# EAGLE board BeagleBeer (EAGLE 6.4)
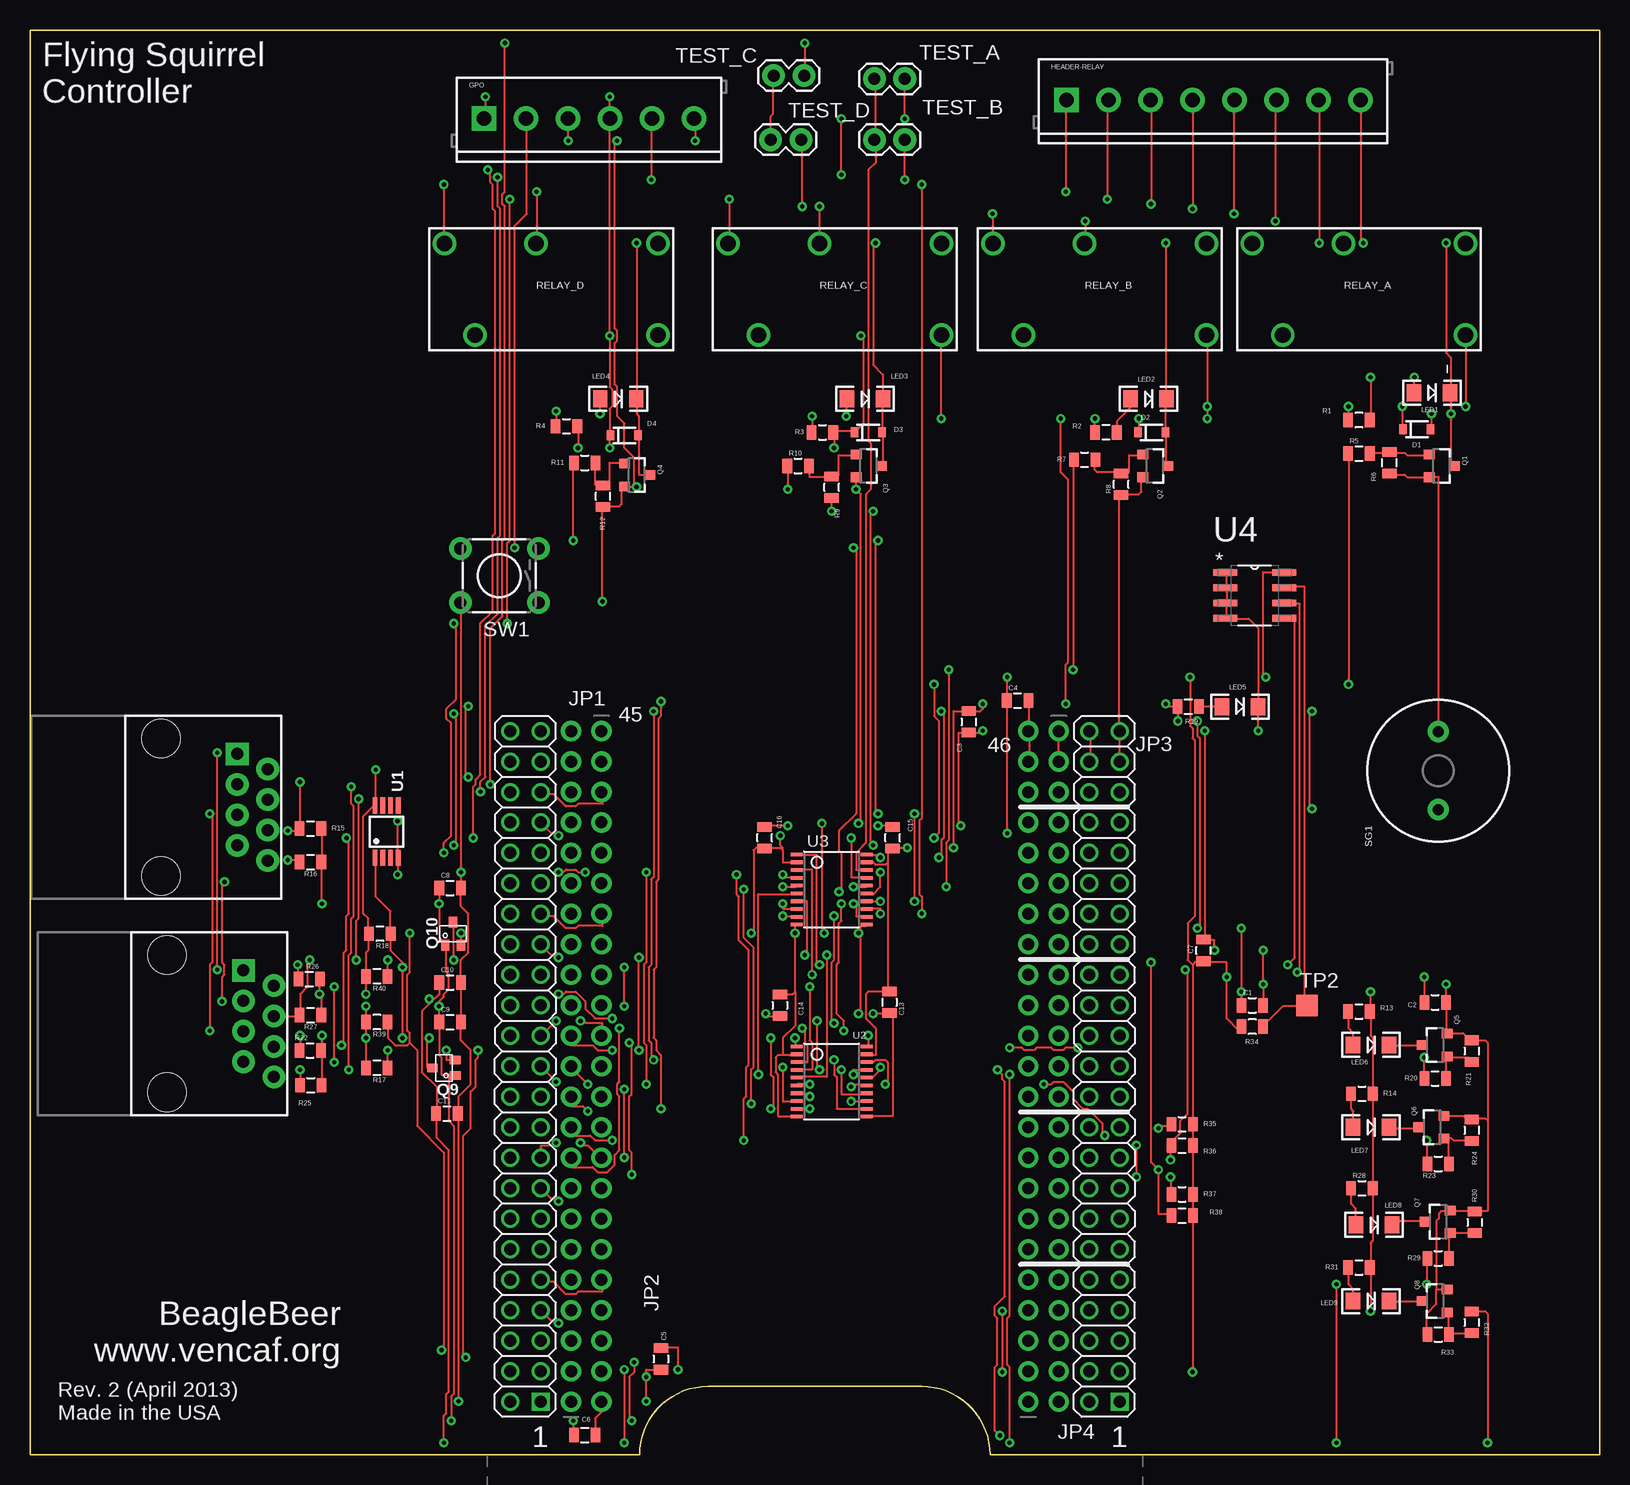
[diagram p2: board, top side]
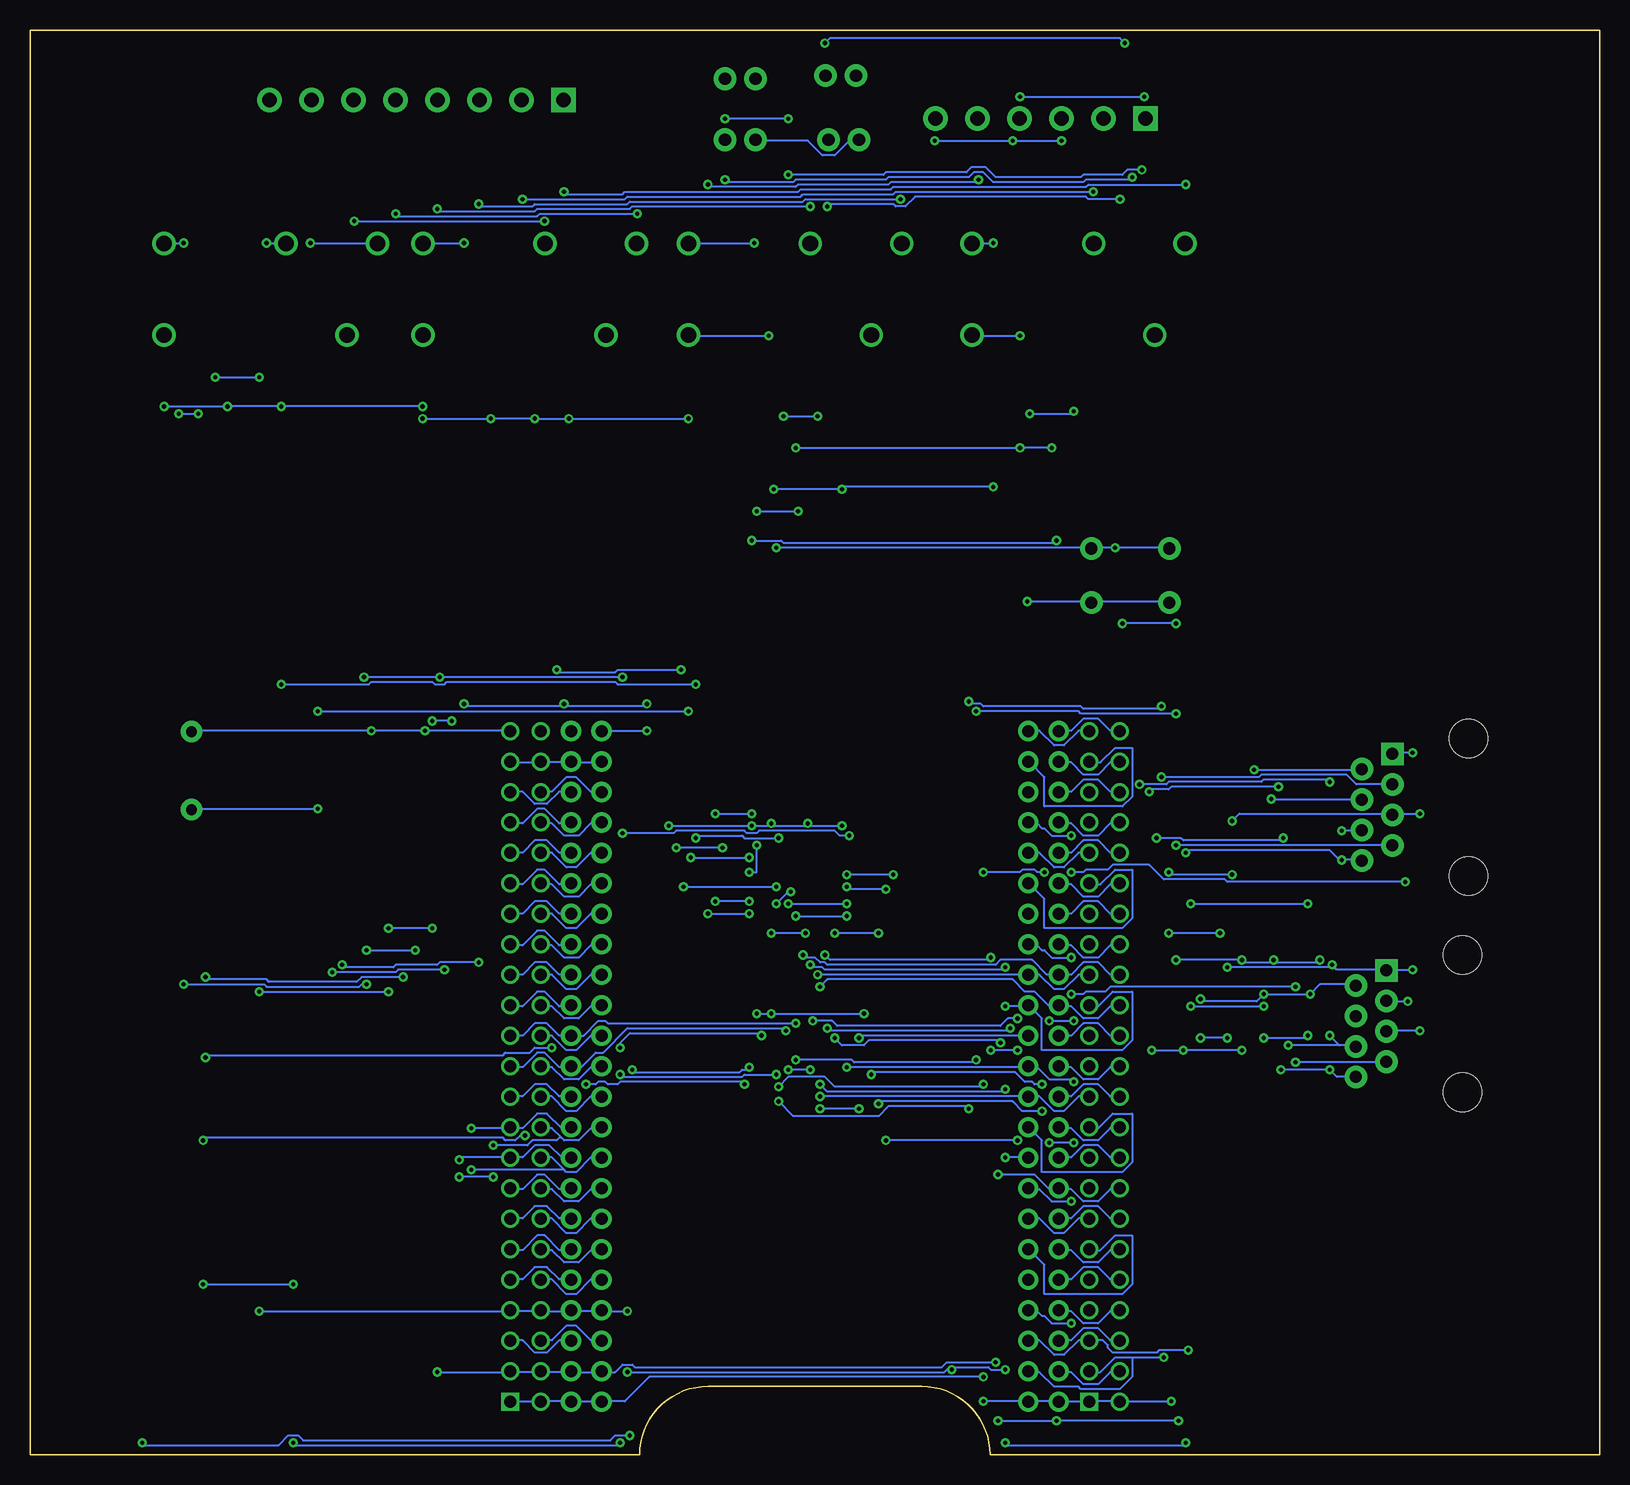
[diagram p3: board, bottom side, seen from below]

Size 130.81 x 118.75 mm. Coordinates in mm from the lower left corner, seen from the top.
Copper layers (1*16): Top 0.0178mm / dielectric 59mil / Bottom 0.0178mm
Design rules "SSC-EAGLE-2Lyr_v1.0.0.3": minimum track width 6mil, minimum drill 14mil, track to track 6mil, track to pad 6mil, pad to pad 6mil, via to via 6mil, smd to smd 6mil, copper to edge 20mil, drill to drill 16mil, minimum pad ring 8mil, minimum via ring 8mil, stop-mask expansion 3mil, vias tented up to drill 0mil, thermal gap 10mil

## Footprints (pad centres in the part's own frame; a part is rotated, then mirrored left to right if it is on the bottom)
0805 = smd 0.8 x 1.2: 1 -0.9,0; 2 0.9,0
SOD-323 = smd 0.63 x 0.83: 1 -1.15,0; 2 1.15,0
SCREWTERMINAL-3.5MM-6 = drill 1.2 pad 2.032 square: 1 0,0 | drill 1.2 pad 2.032: 2 3.5,0; 3 7,0; 4 10.5,0; 5 14,0; 6 17.5,0
SCREWTERMINAL-3.5MM-8 = drill 1.2 pad 2.032 square: 1 0,0 | drill 1.2 pad 2.032: 2 3.5,0; 3 7,0; 4 10.5,0; 5 14,0; 6 17.5,0; 7 21,0; 8 24.5,0
1X23_ROUND_70MIL = drill 1 pad 1.676: 1 -27.94,0; 2 -25.4,0; 3 -22.86,0; 4 -20.32,0; 5 -17.78,0; 6 -15.24,0; 7 -12.7,0; 8 -10.16,0; 9 -7.62,0; 10 -5.08,0; 11 -2.54,0; 12 0,0; 13 2.54,0; 14 5.08,0; 15 7.62,0; 16 10.16,0; 17 12.7,0; 18 15.24,0; 19 17.78,0; 20 20.32,0; 21 22.86,0; 22 25.4,0; 23 27.94,0
LED-1206 = smd 1.2 x 1.4: A -1.5,0; C 1.5,0
SOT23-3 = smd 0.8 x 0.9: 1 -0.95,-1; 2 0.95,-1; 3 0,1.1
SOT323 = smd 0.7 x 0.9: 1 -0.65,-0.95; 2 0.65,-0.95; 3 0,0.95
RELAY-G5Q = drill 1.3: 1 8.89,3.81; 2 -1.27,3.81; 3 -8.89,3.81; 4 -6.35,-3.81; 5 8.89,-3.81
RJ45-8 = drill 1 pad 1.88 square: 1 -4.445,6.35 | drill 1 pad 1.88: 2 -3.175,8.89; 3 -1.905,6.35; 4 -0.635,8.89; 5 0.635,6.35; 6 1.905,8.89; 7 3.175,6.35; 8 4.445,8.89 | hole 3.2: -5.715,0; 5.715,0
BUZZER-12MM = drill 0.9 pad 1.778: + 3.25,0; - -3.25,0
TACTILE-PTH = drill 1.016 pad 1.88: 1 -3.251,2.261; 2 3.251,2.261; 3 -3.251,-2.261; 4 3.251,-2.261
1X02 = drill 1.016 pad 1.88: 1 0,0; 2 2.54,0
TP18SQ = smd 1.8 x 1.8: TP 0,0
UMAX8 = smd 0.4 x 1.35: 1 -0.975,-2.175; 2 -0.325,-2.175; 3 0.325,-2.175; 4 0.975,-2.175; 5 0.975,2.175; 6 0.325,2.175; 7 -0.325,2.175; 8 -0.975,2.175
TSSOP20 = smd 0.305 x 0.991: 1 -2.925,-2.918; 2 -2.275,-2.918; 3 -1.625,-2.918; 4 -0.975,-2.918; 5 -0.325,-2.918; 6 0.325,-2.918; 7 0.975,-2.918; 8 1.625,-2.918; 9 2.275,-2.918; 10 2.925,-2.918; 11 2.925,2.918; 12 2.275,2.918; 13 1.625,2.918; 14 0.975,2.918; 15 0.325,2.918; 16 -0.325,2.918; 17 -0.975,2.918; 18 -1.625,2.918; 19 -2.275,2.918; 20 -2.925,2.918
SOIC127P600X175-8N = smd 1.981 x 0.559: 1 -2.464,1.905; 2 -2.464,0.635; 3 -2.464,-0.635; 4 -2.464,-1.905; 5 2.464,-1.905; 6 2.464,-0.635; 7 2.464,0.635; 8 2.464,1.905
BEAGLEBEER_SHIELD = drill 1 square: 1 -22.225,-1.27; 47 26.035,-1.27 | drill 1: 2 -24.765,-1.27; 3 -22.225,1.27; 4 -24.765,1.27; 5 -22.225,3.81; 6 -24.765,3.81; 7 -22.225,6.35; 8 -24.765,6.35; 9 -22.225,8.89; 10 -24.765,8.89; 11 -22.225,11.43; 12 -24.765,11.43; 13 -22.225,13.97; 14 -24.765,13.97; 15 -22.225,16.51; 16 -24.765,16.51; 17 -22.225,19.05; 18 -24.765,19.05; 19 -22.225,21.59; 20 -24.765,21.59; 21 -22.225,24.13; 22 -24.765,24.13; 23 -22.225,26.67; 24 -24.765,26.67; 25 -22.225,29.21; 26 -24.765,29.21; 27 -22.225,31.75; 28 -24.765,31.75; 29 -22.225,34.29; 30 -24.765,34.29; 31 -22.225,36.83; 32 -24.765,36.83; 33 -22.225,39.37; 34 -24.765,39.37; 35 -22.225,41.91; 36 -24.765,41.91; 37 -22.225,44.45; 38 -24.765,44.45; 39 -22.225,46.99; 40 -24.765,46.99; 41 -22.225,49.53; 42 -24.765,49.53; 43 -22.225,52.07; 44 -24.765,52.07; 45 -22.225,54.61; 46 -24.765,54.61; 48 23.495,-1.27; 49 26.035,1.27; 50 23.495,1.27; 51 26.035,3.81; 52 23.495,3.81; 53 26.035,6.35; 54 23.495,6.35; 55 26.035,8.89; 56 23.495,8.89; 57 26.035,11.43; 58 23.495,11.43; 59 26.035,13.97; 60 23.495,13.97; 61 26.035,16.51; 62 23.495,16.51; 63 26.035,19.05; 64 23.495,19.05; 65 26.035,21.59; 66 23.495,21.59; 67 26.035,24.13; 68 23.495,24.13; 69 26.035,26.67; 70 23.495,26.67; 71 26.035,29.21; 72 23.495,29.21; 73 26.035,31.75; 74 23.495,31.75; 75 26.035,34.29; 76 23.495,34.29; 77 26.035,36.83; 78 23.495,36.83; 79 26.035,39.37; 80 23.495,39.37; 81 26.035,41.91; 82 23.495,41.91; 83 26.035,44.45; 84 23.495,44.45; 85 26.035,46.99; 86 23.495,46.99; 87 26.035,49.53; 88 23.495,49.53; 89 26.035,52.07; 90 23.495,52.07; 91 26.035,54.61; 92 23.495,54.61

## Placement (x,y rotation side)
C1  0.1 uF  [0805]  101.85,37.47 0 top
C2  0.1 uF  [0805]  117.09,37.72 0 top
C3  0.1 uF  [0805]  78.23,61.09 270 top
C4  0.1 uF  [0805]  82.3,62.87 0 top
C5  0.1 uF  [0805]  52.58,8 270 top
C6  0.1 uF  [0805]  46.23,1.65 0 top
C7  0.1 uF  [0805]  97.79,42.04 90 top
C8  0.1 uF  [0805]  35,47.24 0 top
C9  0.1 uF  [0805]  35,36.07 0 top
C10  0.1 uF  [0805]  35,39.37 0 top
C11  0.1 uF  [0805]  34.75,28.45 0 top
C13  0.1 uF  [0805]  71.63,37.72 270 top
C14  0.1 uF  [0805]  62.48,37.47 270 top
C15  0.1 uF  [0805]  71.88,51.44 90 top
C16  0.1 uF  [0805]  61.21,51.44 90 top
D1  1N4148WX-TP  [SOD-323]  115.57,85.47 0 top
D2  1N4148WX-TP  [SOD-323]  93.47,85.22 0 top
D3  1N4148WX-TP  [SOD-323]  69.85,85.22 0 top
D4  1N4148WX-TP  [SOD-323]  49.53,84.96 0 top
GPO  M063.5MM-SCREW  [SCREWTERMINAL-3.5MM-6]  37.85,111.38 0 top
HEADER-RELAY  M083.5MM-SCREW  [SCREWTERMINAL-3.5MM-8]  86.36,112.9 0 top
JP1  SF_PRT-00116  [1X23_ROUND_70MIL]  47.62,32.38 270 top
JP2  SF_PRT-00116  [1X23_ROUND_70MIL]  45.08,32.38 90 top
JP3  SF_PRT-00116  [1X23_ROUND_70MIL]  85.72,32.38 270 top
JP4  SF_PRT-00116  [1X23_ROUND_70MIL]  83.18,32.38 90 top
LED1  LG N971-KN-1  [LED-1206]  116.84,88.52 0 top
LED2  LG N971-KN-1  [LED-1206]  93.22,88.01 0 top
LED3  LG N971-KN-1  [LED-1206]  69.6,88.01 0 top
LED4  LG N971-KN-1  [LED-1206]  49.02,88.01 0 top
LED5  LG N971-KN-1  [LED-1206]  100.84,62.36 0 top
LED6  LG N971-KN-1  [LED-1206]  111.76,34.16 0 top
LED7  LG N971-KN-1  [LED-1206]  111.76,27.3 0 top
LED8  LG N971-KN-1  [LED-1206]  112.01,19.18 0 top
LED9  LG N971-KN-1  [LED-1206]  111.76,12.83 0 top
Q1  MMBT2222A-7-F  [SOT23-3]  117.6,82.42 270 top
Q2  MMBT2222A-7-F  [SOT23-3]  93.73,82.42 270 top
Q3  MMBT2222A-7-F  [SOT23-3]  69.85,82.42 270 top
Q4  MMBT2222A-7-F  [SOT23-3]  50.55,81.66 270 top
Q5  MMBT2222A-7-F  [SOT23-3]  117.09,34.16 90 top
Q6  MMBT2222A-7-F  [SOT23-3]  116.84,27.3 90 top
Q7  MMBT2222A-7-F  [SOT23-3]  117.35,19.43 90 top
Q8  MMBT2222A-7-F  [SOT23-3]  117.09,12.83 90 top
Q9  BSS138  [SOT323]  34.49,32.26 90 top
Q10  BSS138  [SOT323]  35.26,43.43 0 top
R1  1K  [0805]  110.74,86.23 180 top
R2  1K  [0805]  89.66,85.22 180 top
R3  1K  [0805]  66.04,85.22 0 top
R4  1K  [0805]  44.7,85.72 0 top
R5  1K  [0805]  110.74,83.44 0 top
R6  10K  [0805]  113.28,82.68 90 top
R7  1K  [0805]  87.88,82.93 0 top
R8  10K  [0805]  90.93,80.9 90 top
R9  1K  [0805]  66.8,80.64 90 top
R10  10K  [0805]  64.01,82.42 0 top
R11  1K  [0805]  46.23,82.68 0 top
R12  10K  [0805]  47.75,79.88 90 top
R13  1K  [0805]  110.74,36.96 0 top
R14  1K  [0805]  111,30.1 0 top
R15  2.2K  [0805]  23.37,52.2 0 top
R16  2.2K  [0805]  23.37,49.4 0 top
R17  10K  [0805]  28.91,32.26 180 top
R18  10K  [0805]  29.16,43.43 180 top
R19  1K  [0805]  96.52,62.36 0 top
R20  1K  [0805]  117.09,31.37 0 top
R21  10K  [0805]  120.14,33.66 270 top
R22  2.2K  [0805]  23.34,33.71 0 top
R23  1K  [0805]  117.35,24.26 0 top
R24  10K  [0805]  120.14,27.05 270 top
R25  2.2K  [0805]  23.39,30.81 0 top
R26  4.7K  [0805]  23.27,39.65 0 top
R27  4.7K  [0805]  23.37,36.65 0 top
R28  1K  [0805]  111,22.23 0 top
R29  1K  [0805]  117.35,16.38 0 top
R30  10K  [0805]  120.4,19.38 270 top
R31  1K  [0805]  110.74,15.62 0 top
R32  1K  [0805]  120.14,11.05 270 top
R33  10K  [0805]  117.35,10.03 0 top
R34  10K  [0805]  101.85,35.69 180 top
R35  10K  [0805]  96.01,27.56 0 top
R36  10K  [0805]  96.01,25.78 0 top
R37  10K  [0805]  96.01,21.72 0 top
R38  10K  [0805]  96.01,19.94 0 top
R39  10K  [0805]  28.91,36.07 180 top
R40  10K  [0805]  28.91,39.88 180 top
RELAY_A  RELAYPTH  [RELAY-G5Q]  110.74,97.16 0 top
RELAY_B  RELAYPTH  [RELAY-G5Q]  89.15,97.16 0 top
RELAY_C  RELAYPTH  [RELAY-G5Q]  67.06,97.16 0 top
RELAY_D  RELAYPTH  [RELAY-G5Q]  43.43,97.16 0 top
RJ1  RJ45-8PTH  [RJ45-8]  11.43,35.94 270 top
RJ2  RJ45-8PTH  [RJ45-8]  10.92,53.98 270 top
SG1  BUZZERPTH  [BUZZER-12MM]  117.35,57.02 270 top
SW1  SF_COM-00097  [TACTILE-PTH]  39.12,73.28 180 top
TEST_A  SF_PRT-00116  [1X02]  70.36,114.68 0 top
TEST_B  SF_PRT-00116  [1X02]  70.36,109.6 0 top
TEST_C  SF_PRT-00116  [1X02]  61.98,114.94 0 top
TEST_D  SF_PRT-00116  [1X02]  61.72,109.6 0 top
TP2  TPTP18SQ  [TP18SQ]  106.43,37.47 0 top
U1  TEMPERATURE-SENSORUMAX8  [UMAX8]  29.72,51.94 0 top
U2  TXB0108  [TSSOP20]  66.8,31.11 270 top
U3  TXB0108  [TSSOP20]  66.8,47.12 270 top
U4  CAT24C256WI-GT3  [SOIC127P600X175-8N]  102.06,71.63 0 top
U5  BEAGLEBONE_OUTLINEBEAGLEBEER  [BEAGLEBEER_SHIELD]  64.77,5.71 0 top

## Tracks (layer width: path | path; a pad name or v marks a point on that pad's centre or on a via)
3.3V  (via drill 0.36)
  Top 0.152: R15.2 24.33,52.02 24.33,49.58 R16.2 24.33,49.38 v24.33,45.92 | C8.1 34.09,47.14 v34.09,45.92 34.09,43.08 34.49,42.67 Q10.1 34.7,42.47 34.7,40.23 34.9,40.03 34.9,38.81 34.49,38.41 34.49,38.2 34.09,37.8 v34.09,37.39 34.09,36.17 C9.1 34.09,35.97 34.09,33.33 34.29,33.12 34.29,31.7 34.9,31.7 | R25.2 24.33,30.89 24.33,33.53 R22.2 24.33,33.73 v24.33,34.95 | R17.2 27.99,32.31 v27.99,34.75 27.99,35.97 R39.2 27.99,36.17 v27.99,37.39 | 34.9,31.7 35.31,31.7 Q9.1 | v45.26,2.85 45.26,1.83 C6.1 | v35.1,2.85 35.1,4.88 35.31,5.08 35.31,27.43 34.9,27.84 34.9,31.7 | R34.2 100.94,35.56 100.94,35.36 100.74,35.36 99.72,36.37 v99.72,39.83 99.72,41.05 97.89,41.05 C7.1 97.69,41.05 97.08,41.05 96.88,40.84 | v116.18,39.83 116.18,37.8 C2.1 | 96.88,40.84 96.88,27.64 R35.2 96.88,27.43 96.88,25.81 R36.2 96.88,25.6 96.88,21.74 R37.2 96.88,21.54 96.88,20.12 R38.2 96.88,19.91 v96.88,6.91 | 62.74,33.33 63.75,33.33 U2.2 | 62.74,33.33 62.33,33.33 62.13,33.12 62.13,31.9 62.33,31.7 62.33,28.25 63.75,28.25 U2.10 | 63.75,38.61 v63.75,43.48 63.75,44.09 U3.10 | 63.75,38.61 63.55,38.41 62.54,38.41 C14.1 | 62.74,33.33 62.74,34.75 63.75,35.76 63.75,38.61 | 62.74,50.39 62.74,49.38 63.75,49.38 U3.2 | 62.74,50.39 62.54,50.6 61.32,50.6 C16.1 61.11,50.6 60.5,50.6 60.3,50.39 60.3,43.69 v60.1,43.48 | v81.43,51.82 81.43,62.79 C4.1 81.43,62.99 v81.43,64.82 | v62.54,51.61 62.54,50.8 62.74,50.6 62.74,50.39 | v102.97,64.82 102.77,65.02 102.77,73.56 104.39,73.56 U4.8 | 96.88,40.84 96.47,41.25 96.47,44.3 97.08,44.91 97.08,59.54 96.88,59.74 96.88,60.55 96.67,60.76 v96.67,64.82 | v50.14,2.85 49.94,3.05 49.94,6.5 50.34,6.91 v50.34,7.72
  Bottom 0.152: v34.09,45.92 v24.33,45.92 | v24.33,34.95 24.54,34.75 v27.99,34.75 | v35.1,2.85 v45.26,2.85 v50.14,2.85 | v34.09,37.39 v27.99,37.39 | v116.18,39.83 115.98,39.62 111.1,39.62 110.9,39.42 103.58,39.42 103.18,39.83 v99.72,39.83 | v96.88,6.91 90.98,6.91 U5.49 90.78,6.91 88.34,6.91 U5.50 88.14,6.91 85.9,6.91 JP3.22 85.7,6.91 83.26,6.91 JP4.2 83.06,6.91 82.04,6.91 81.43,7.52 80.62,7.52 80.42,7.32 54.81,7.32 54.41,7.72 v50.34,7.72 | v81.43,51.82 77.17,51.82 76.96,52.02 71.27,52.02 71.07,51.82 70.26,51.82 70.05,52.02 63.75,52.02 63.35,51.61 v62.54,51.61 | v81.43,64.82 v96.67,64.82 v102.97,64.82 | v60.1,43.48 v63.75,43.48
5V  (via drill 0.36)
  Top 0.152: v37.95,113.18 37.95,111.56 GPO.1 | v48.31,113.18 48.31,111.56 GPO.4 48.31,111.35 v48.31,93.27 48.31,89 48.51,88.8 48.51,87.38 48.31,87.17 48.31,85.14 D4.1 48.31,84.94 v48.31,83.92 | v45.67,83.92 45.67,85.55 R4.2 | v114.35,87.38 114.35,85.55 D1.1 | v109.88,87.38 109.88,86.36 R1.2 | RELAY_A.5 v119.63,87.38 | v69.24,93.27 69.44,93.07 69.44,85.95 68.83,85.34 D3.1 68.63,85.34 67.01,85.34 R3.2 67.01,85.14 v67.01,83.92 | v92.41,86.36 92.41,85.34 D2.1 | v88.75,86.36 88.75,85.34 R2.2 | v98.1,86.36 v98.1,87.38 98.1,93.27 RELAY_B.5 | v75.95,86.36 RELAY_C.5 | 33.88,28.45 33.88,30.68 32.66,31.9 32.66,36.98 33.27,37.59 | 33.27,37.59 34.09,38.41 34.09,39.22 C10.1 | R26.2 24.13,39.62 v24.13,38.41 24.13,38.2 24.33,38 24.33,36.78 R27.2 | v28.8,57.1 28.8,54.25 U1.8 28.6,54.05 27.79,53.24 27.79,45.11 28.19,44.7 28.19,43.48 R18.2 28.19,43.28 28.19,42.06 27.99,41.86 27.99,40.03 R40.2 27.99,39.83 v27.99,38.41 | v33.27,38 33.27,37.59 | v54,7.11 54,8.94 52.58,8.94 C5.1 | v81.03,11.99 v81.03,6.91 | v111.71,38.61 111.71,36.98 R13.2 111.71,36.78 111.71,34.95 111.91,34.75 111.91,30.28 R14.2 111.91,30.07 111.91,22.35 R28.2 111.91,22.15 111.91,17.88 111.71,17.68 111.71,15.65 R31.2 111.71,15.44 v111.71,11.99 | C1.1 100.94,37.59 v100.94,38.61 v100.94,43.89 | U2.19 69.85,33.33 70.46,33.33 70.46,35.56 69.65,36.37 69.65,38.41 69.85,38.61 71.48,38.61 C13.1 71.48,38.81 71.48,49.38 | 71.48,49.38 71.27,49.17 70.46,49.17 70.26,49.38 69.85,49.38 U3.19 | 71.48,49.38 71.48,50.6 71.88,50.6 | v76.96,50.6 76.96,61.98 78.18,61.98 C3.1 78.38,61.98 79.2,61.98 79.4,62.18 v79.4,62.59 | 71.88,50.6 v73.1,50.6
  Top 0.152: 71.88,50.6 C15.1 | v94.64,62.59 94.64,62.38 95.45,62.38 R19.1 95.66,62.18 v95.66,61.16 | v97.28,43.89 97.49,44.09 97.49,59.74 97.28,59.94 v97.28,61.16 | 33.88,28.45 33.88,26.42 34.9,25.4 34.9,5.28 34.7,5.08 34.7,3.45 34.49,3.25 v34.49,1.02 | v49.53,7.11 v49.53,1.02 | 33.88,28.45 C11.1 | v85.9,86.36 85.9,81.89 86.51,81.28 86.51,66.04 86.31,65.84 v86.31,62.59
  Bottom 0.152: v48.31,113.18 v37.95,113.18 | v45.67,83.92 v48.31,83.92 v67.01,83.92 | v48.31,93.27 52.17,93.27 RELAY_D.5 | v119.63,87.38 v114.35,87.38 v109.88,87.38 v98.1,87.38 | v69.24,93.27 75.95,93.27 RELAY_C.5 | v98.1,86.36 v92.41,86.36 v88.75,86.36 v85.9,86.36 v75.95,86.36 | RJ1.2 20.47,39.22 23.32,39.22 v24.13,38.41 v27.99,38.41 28.6,37.8 33.07,37.8 v33.27,38 | v28.8,57.1 19.86,57.1 RJ2.2 | 54.41,7.11 v54,7.11 | 54.41,7.11 54.61,6.91 v81.03,6.91 | v81.03,11.99 83.06,11.99 JP4.4 83.26,11.99 85.7,11.99 JP3.20 85.9,11.99 88.14,11.99 U5.54 88.34,11.99 90.78,11.99 U5.53 90.98,11.99 v111.71,11.99 | v111.71,38.61 v100.94,38.61 | v73.1,50.6 v76.96,50.6 | v94.64,62.59 94.44,62.38 86.31,62.38 | 86.31,62.38 79.6,62.38 v79.4,62.59 | v97.28,43.89 v100.94,43.89 | v95.66,61.16 v97.28,61.16 | v34.49,1.02 34.7,0.81 49.33,0.81 v49.53,1.02 | v49.53,7.11 50.75,7.11 50.95,7.32 54.2,7.32 54.41,7.11 | 86.31,62.38 v86.31,62.59
ALARM  (via drill 0.36)
  Top 0.152: v70.87,45.11 70.87,45.52 69.85,45.52 U3.13 | v74.32,45.11 74.32,46.53 74.12,46.74 74.12,52.83 74.32,53.03 v74.32,105.87 | v51.77,106.27 51.77,111.35 GPO.5
  Bottom 0.152: v74.32,45.11 v70.87,45.11 | v74.32,105.87 74.12,105.66 67.01,105.66 66.8,105.87 59.28,105.87 59.08,106.07 51.97,106.07 v51.77,106.27
ALARM_3P3  (via drill 0.36)
  Top 0.152: v62.74,45.92 62.74,45.52 63.75,45.52 U3.8 | v67.62,45.92 67.62,44.5 67.41,44.3 67.41,41.05 67.21,40.84 67.21,36.78 67.82,36.17 v67.82,35.36
  Bottom 0.152: U5.69 90.78,32.31 89.76,32.31 88.54,33.53 87.94,33.53 86.72,32.31 85.9,32.31 JP3.12 85.7,32.31 84.89,32.31 83.67,33.53 83.06,33.53 81.03,35.56 68.02,35.56 v67.82,35.36 | v67.62,45.92 v62.74,45.92
BUZZER  (via drill 0.36)
  Top 0.152: v70.87,49.78 70.87,49.99 69.85,49.99 U3.20 | v75.74,49.78 75.95,49.99 75.95,51.21 76.15,51.41 76.15,61.77 v75.95,61.98 | v106.83,61.98 106.63,61.77 106.63,54.05 v106.83,53.85
  Bottom 0.152: v75.74,49.78 v70.87,49.78 | v106.83,61.98 v75.95,61.98 | v106.83,53.85 117.2,53.85 SG1.+
BUZZER_3P3  (via drill 0.36)
  Top 0.152: v65.79,40.84 65.58,41.05 65.58,49.99 63.96,49.99 U3.1 | v49.53,37.39 v49.53,40.64
  Bottom 0.152: U5.27 42.42,37.39 41.81,37.39 40.59,38.61 38.96,38.61 38.96,34.54 39.78,33.73 46.48,33.73 46.48,36.37 47.5,37.39 JP1.10 47.7,37.39 v49.53,37.39 | v65.79,40.84 65.58,40.64 64.77,40.64 64.57,40.44 49.73,40.44 v49.53,40.64
EEPROM_SCL  (via drill 0.36)
  Top 0.152: v95.05,24.59 95.05,25.6 R36.1 95.05,25.81 95.05,26.01 95.86,26.82 95.86,27.84 96.47,28.45 96.47,40.23 v96.27,40.44 | v105.61,40.23 105.82,40.44 105.82,70.92 104.6,70.92 U4.6
  Bottom 0.152: JP3.15 85.9,24.79 86.51,24.79 87.53,25.81 88.75,25.81 89.76,24.79 90.78,24.79 U5.63 90.98,24.79 94.84,24.79 v95.05,24.59 | v105.61,40.23 100.33,40.23 100.13,40.44 v96.27,40.44
EEPROM_SDA  (via drill 0.36)
  Top 0.152: R38.1 95.05,20.12 94.03,20.12 v94.03,23.77 93.42,24.38 v93.42,41.05 | v104.8,40.84 105.41,41.45 105.41,69.7 104.6,69.7 U4.5
  Bottom 0.152: 86.31,23.77 86.11,23.57 85.29,23.57 84.07,24.79 83.26,24.79 JP4.9 | 86.31,23.77 87.33,24.79 88.14,24.79 U5.64 | 86.31,23.77 v94.03,23.77 | v104.8,40.84 104.6,40.64 100.53,40.64 100.33,40.84 96.88,40.84 96.67,41.05 v93.42,41.05
FLOW_A  (via drill 0.36)
  Top 0.152: v22.5,34.95 22.5,33.73 R22.1 | v72.9,111.35 TEST_A.2 | v67.62,106.68 v67.62,111.35 | v38.15,107.09 38.35,106.88 38.35,106.07 38.56,105.87 38.56,103.83 38.76,103.63 38.76,76.81 38.56,76.61 38.56,70.31 37.54,69.29 37.54,56.69 37.14,56.29 37.14,55.88 36.93,55.68 v36.93,51.41 | v26.37,51.41 26.57,51.21 26.57,45.11 26.37,44.91 26.37,42.06 26.16,41.86 26.16,34.34 v25.96,34.14
  Bottom 0.152: 21.69,34.14 v22.5,34.95 | 21.69,34.14 20.47,34.14 RJ1.6 | v67.62,111.35 v72.9,111.35 | v67.62,106.68 59.69,106.68 59.49,106.88 52.78,106.88 52.38,107.29 51.16,107.29 50.34,106.48 43.23,106.48 43.03,106.68 39.78,106.68 39.37,107.09 v38.15,107.09 | v36.93,51.41 34.9,51.41 34.7,51.21 26.57,51.21 v26.37,51.41 | 21.69,34.14 v25.96,34.14
FLOW_A_3P3
  Bottom 0.152: JP2.2 45.06,6.91 44.04,6.91 43.03,5.89 41.81,5.89 40.79,6.91 40.18,6.91 U5.4
FLOW_B  (via drill 0.36)
  Top 0.152: v22.5,32.11 22.5,30.89 R25.1 | v72.9,106.27 TEST_B.2 | v38.96,106.48 38.96,104.04 39.17,103.83 39.17,76.61 38.96,76.4 38.96,70.1 37.95,69.09 37.95,56.49 37.54,56.08 v37.54,55.27 | v26.77,55.68 26.77,54.25 26.98,54.05 26.98,44.91 26.77,44.7 26.77,41.86 26.57,41.66 v26.57,32.11
  Bottom 0.152: RJ1.8 21.9,31.5 v22.5,32.11 v26.57,32.11 | v72.9,106.27 72.7,106.07 67.21,106.07 67.01,106.27 59.49,106.27 59.28,106.48 52.58,106.48 52.17,106.88 51.36,106.88 50.55,106.07 43.03,106.07 42.82,106.27 39.17,106.27 v38.96,106.48 | v37.54,55.27 37.34,55.47 35.92,55.47 35.71,55.68 v26.77,55.68
FLOW_B_3P3
  Bottom 0.152: JP2.3 45.06,9.55 44.04,9.55 43.03,10.57 41.81,10.57 40.79,9.55 40.18,9.55 U5.6
FLOW_C  (via drill 0.36)
  Top 0.152: v21.49,52.02 22.3,52.02 R15.1 22.5,52.22 v22.5,56.08 | v64.57,117.65 64.57,115.01 TEST_C.2 | v39.57,117.65 39.57,105.26 39.37,105.05 39.37,104.24 39.57,104.04 39.57,76.4 39.37,76.2 39.37,69.9 38.35,68.89 v38.35,55.88
  Bottom 0.152: v21.49,52.02 19.86,52.02 RJ2.6 | v64.57,117.65 64.16,118.06 39.98,118.06 v39.57,117.65 | v38.35,55.88 36.12,55.88 35.92,56.08 28.19,56.08 27.99,56.29 22.71,56.29 v22.5,56.08
FLOW_C_3P3
  Bottom 0.152: JP2.6 45.06,17.07 44.04,17.07 43.03,16.05 41.81,16.05 40.79,17.07 40.18,17.07 U5.12
FLOW_D  (via drill 0.36)
  Top 0.152: v21.49,49.58 22.3,49.58 R16.1 | v64.36,104.04 64.36,109.53 TEST_D.2 | v39.98,104.65 39.98,76.2 39.78,76 v39.78,69.29 | v35.31,69.29 35.51,69.09 35.51,62.99 34.7,62.18 34.7,61.37 35.1,60.96 35.1,51.61 34.49,51 v34.49,50.19
  Bottom 0.152: RJ2.8 19.86,49.58 v21.49,49.58 21.69,49.58 22.5,50.39 34.29,50.39 v34.49,50.19 | v64.36,104.04 64.16,104.24 58.88,104.24 58.67,104.04 57.86,104.04 57.05,104.85 42.82,104.85 42.62,104.65 v39.98,104.65 | v35.31,69.29 v39.78,69.29
FLOW_D_3P3
  Bottom 0.152: JP2.7 45.06,19.71 44.04,19.71 43.03,20.73 41.81,20.73 40.79,19.71 40.18,19.71 U5.14
GND  (via drill 0.36)
  Top 0.152: v30.63,48.36 30.63,49.58 U1.4 30.63,49.78 v30.63,52.83 | v14.99,35.36 14.99,40.84 15.19,41.05 15.19,53.24 v14.99,53.44 | 88.34,4.47 U5.48 | 90.78,4.47 U5.47 | C6.2 47.09,1.83 47.09,3.05 47.7,3.66 47.7,4.27 JP1.23 | v51.36,4.47 v51.36,6.5 51.36,7.11 52.58,7.11 C5.2 | 42.62,4.47 U5.1 | v35.71,4.47 35.71,28.45 | 35.71,28.45 35.71,29.87 36.73,30.89 36.73,33.73 35.92,34.54 35.92,35.97 C9.2 35.92,36.17 35.92,39.22 C10.2 35.92,39.42 35.92,41.25 36.53,41.86 36.53,45.11 35.92,45.72 35.92,47.14 C8.2 35.92,47.35 v35.92,48.56 35.92,70.92 SW1.2 | 35.71,28.45 C11.2 | 39.98,4.47 U5.2 | v44.86,109.53 44.86,111.35 GPO.3 | v55.42,109.53 55.42,111.35 GPO.6 | v63.14,80.47 63.14,82.3 R10.1 | Q3.2 68.83,81.28 v68.83,80.47 69.24,80.06 69.24,52.83 v69.04,52.63 | v47.7,71.12 47.7,78.84 R12.1 47.9,79.05 49.12,79.05 49.33,79.25 49.33,80.67 49.53,80.67 Q4.2 49.73,80.67 50.34,80.67 | v48.92,109.53 48.72,109.32 48.72,93.88 48.92,93.67 48.92,92.86 48.72,92.66 48.72,89.2 48.92,89 48.92,86.56 49.53,85.95 49.53,83.92 50.34,83.11 50.34,80.67 | 50.34,80.67 v50.55,80.67 | U2.11 69.85,28.25 71.88,28.25 71.88,36.78 71.68,36.98 C13.2 71.48,36.78 v70.26,36.78 | 69.24,43.48 69.24,36.98 v69.04,36.78 | 69.24,43.48 69.24,44.09 69.65,44.09 U3.11 | v61.32,36.78 61.32,36.58 62.33,36.58 C14.2 | v63.14,52.43 61.32,52.43 C16.2 | v70.66,52.43 71.88,52.43 C15.2 | v79.4,60.35 79.4,60.15 78.38,60.15 C3.2 78.18,60.15 77.37,60.15 77.37,52.63 v77.57,52.43 | C4.2 83.26,62.79 83.26,60.35 JP4.23 83.26,60.15 83.26,57.91 JP4.22 | v69.04,43.48 69.24,43.48 | v66.19,43.48 65.99,43.69 v65.99,52.63 | 117.2,13.82 118.01,13.82 Q8.2
  Top 0.152: 117.2,13.82 117.2,12.6 116.38,11.79 116.38,10.16 R33.1 | Q6.2 118.01,28.25 119.43,28.25 119.63,28.04 120.04,28.04 R24.1 120.24,28.04 121.26,28.04 121.46,27.84 | 121.46,27.84 121.46,20.32 120.45,20.32 R30.1 120.24,20.32 118.42,20.32 Q7.2 118.21,20.32 117.6,20.32 117.4,20.12 117.4,19.71 117.2,19.51 117.2,13.82 | v118.01,39.22 118.01,37.8 C2.2 118.01,37.59 118.01,35.15 Q5.2 118.21,35.15 119.43,35.15 119.63,34.95 119.63,34.54 120.04,34.54 R21.1 120.24,34.54 121.26,34.54 121.46,34.34 121.46,27.84 | C1.2 102.77,37.59 v102.77,39.22 v102.77,42.06 | v98.7,42.06 98.7,42.88 97.89,42.88 C7.2 97.89,43.08 v97.89,60.35 | R6.1 113.34,81.69 114.55,81.69 114.76,81.48 116.59,81.48 Q1.2 116.79,81.48 117.4,81.48 117.4,60.35 SG1.- | U4.1 99.72,73.36 99.72,72.34 U4.2 99.72,72.14 99.72,71.12 U4.3 99.72,70.92 99.72,69.9 U4.4 99.72,69.7 101.55,69.7 102.36,68.89 102.36,62.38 LED5.C 102.36,62.18 v102.36,60.35 | U5.90 88.34,57.91 88.34,60.15 U5.92 | JP3.2 85.7,57.91 85.7,60.15 JP3.1 | Q2.2 92.61,81.28 92.61,80.26 92.41,80.06 90.98,80.06 R8.1 90.78,79.86 90.78,60.35 U5.91 90.78,60.15 90.78,57.91 U5.89
  Bottom 0.152: v35.92,48.56 35.71,48.36 v30.63,48.36 | v30.63,52.83 30.02,53.44 17.42,53.44 RJ2.5 17.22,53.44 v14.99,53.44 | v14.99,35.36 17.63,35.36 RJ1.5 | U5.47 90.78,4.47 88.34,4.47 U5.48 88.14,4.47 85.9,4.47 JP3.23 85.7,4.47 83.26,4.47 JP4.1 83.06,4.47 81.23,4.47 79.2,6.5 v51.36,6.5 | v51.36,4.47 47.7,4.47 JP1.23 47.5,4.47 45.26,4.47 JP2.1 45.06,4.47 42.62,4.47 U5.1 42.42,4.47 40.18,4.47 U5.2 39.98,4.47 v35.71,4.47 | v55.42,109.53 v48.92,109.53 v44.86,109.53 | v68.83,80.47 v63.14,80.47 62.94,80.67 v50.55,80.67 | SW1.2 35.92,71.12 42.22,71.12 SW1.1 42.42,71.12 v47.7,71.12 | v70.26,36.78 v69.04,36.78 v61.32,36.78 | 69.04,52.43 v70.66,52.43 v77.57,52.43 | 69.04,52.43 65.99,52.43 | 65.99,52.43 v63.14,52.43 | v79.4,60.35 83.06,60.35 JP4.23 | v66.19,43.48 v69.04,43.48 | 65.99,52.43 v65.99,52.63 | v102.77,39.22 103.18,39.22 103.38,39.01 111.1,39.01 111.3,39.22 v118.01,39.22 | v102.77,42.06 v98.7,42.06 | U5.89 90.78,57.71 88.34,57.71 U5.90 88.14,57.71 85.9,57.71 JP3.2 85.7,57.71 83.26,57.71 JP4.22 | U5.91 90.98,60.35 v97.89,60.35 v102.36,60.35 117.2,60.35 SG1.- | 69.04,52.43 v69.04,52.63
GPIO_A  (via drill 0.36)
  Top 0.152: v68.43,30.68 68.43,30.89 69.65,30.89 U2.15 | v51.36,30.89 51.36,34.14 51.16,34.34 51.16,40.84 51.36,41.05 v51.36,48.56 | v46.28,48.56 45.67,48.56 45.47,48.77 44.65,48.77 44.45,48.56 v44.04,48.56 | v16.21,47.75 16,47.55 16,41.05 16.21,40.84 16.21,40.03 16,39.83 v16,37.8
  Bottom 0.152: v68.43,30.68 67.62,31.5 64.57,31.5 63.75,30.68 51.56,30.68 v51.36,30.89 | v51.36,48.56 48.31,48.56 48.11,48.77 47.09,48.77 46.89,48.56 v46.28,48.56 | v44.04,48.56 43.03,48.56 42.82,48.77 41,48.77 40.59,49.17 37.54,49.17 36.32,47.95 31.24,47.95 31.04,47.75 v16.21,47.75 | v16,37.8 17.63,37.8 RJ1.3
GPIO_A_3P3  (via drill 0.36)
  Top 0.152: v45.87,26.01 45.87,25.81 46.48,25.81 47.5,24.79 JP1.15 | v43.84,26.01 43.64,25.81 42.62,25.81 42.62,24.79 U5.17 | v64.97,30.89 63.96,30.89 U2.6 | v49.53,24.79 v49.53,30.48
  Bottom 0.152: v43.84,26.01 v45.87,26.01 | v64.97,30.89 64.36,30.28 49.73,30.28 v49.53,30.48 | v49.53,24.79 47.7,24.79 JP1.15
GPIO_B  (via drill 0.36)
  Top 0.152: v67.62,32.11 67.62,30.07 69.65,30.07 U2.14 | v65.79,32.11 65.58,32.31 v65.58,36.17 | v48.51,36.37 47.09,36.37 46.28,37.19 46.28,37.8 45.47,38.61 44.65,38.61 44.45,38.41 v44.04,38.41 | v25.35,32.72 v25.35,39.01
  Bottom 0.152: v65.79,32.11 v67.62,32.11 | v65.58,36.17 63.96,36.17 63.55,35.76 49.94,35.76 49.33,36.37 v48.51,36.37 | v44.04,38.41 43.03,38.41 42.82,38.61 41.2,38.61 40.79,39.01 v25.35,39.01 | v25.35,32.72 17.83,32.72 RJ1.7
GPIO_B_3P3  (via drill 0.36)
  Top 0.152: v64.97,29.87 64.77,30.07 63.96,30.07 U2.7
  Bottom 0.152: U5.21 42.62,29.87 43.43,29.87 44.65,28.65 45.47,28.65 46.69,29.87 47.5,29.87 JP1.13 47.7,29.87 v64.97,29.87
GPIO_C  (via drill 0.36)
  Top 0.152: v68.43,29.46 69.65,29.46 U2.13 | v52.58,28.85 52.58,33.33 52.17,33.73 52.17,34.54 51.97,34.75 51.97,40.44 52.17,40.64 52.17,47.75 52.38,47.95 52.38,61.37 52.58,61.57 v52.58,62.79 | v36.53,62.38 36.32,62.18 36.32,56.69 v36.53,56.49
  Bottom 0.152: v68.43,29.46 67.21,28.25 60.1,28.25 59.28,29.06 52.78,29.06 v52.58,28.85 | v52.58,62.79 52.38,62.59 51.56,62.59 51.36,62.38 43.23,62.38 43.03,62.18 36.73,62.18 v36.53,62.38 | v36.53,56.49 28.4,56.49 28.19,56.69 21.08,56.69 20.27,55.88 RJ2.3
GPIO_C_3P3  (via drill 0.36)
  Top 0.152: v62.74,32.31 62.74,29.46 63.75,29.46 U2.8 | v43.84,31.09 U5.23
  Bottom 0.152: v62.74,32.31 47.7,32.31 JP1.12 47.5,32.31 46.89,32.31 45.87,31.29 44.04,31.29 v43.84,31.09
GPIO_D  (via drill 0.36)
  Top 0.152: v67.01,32.92 67.01,31.7 67.21,31.5 67.21,28.85 69.65,28.85 U2.12 | v51.97,32.92 51.77,33.12 51.77,34.34 51.56,34.54 51.56,40.64 51.77,40.84 51.77,47.95 51.97,48.16 v51.97,61.98 | v35.31,61.77 35.51,61.57 35.51,51 v35.31,50.8
  Bottom 0.152: v67.01,32.92 62.33,32.92 62.13,32.72 52.17,32.72 v51.97,32.92 | v51.97,61.98 43.43,61.98 43.23,61.77 v35.31,61.77 | RJ2.7 v35.31,50.8
GPIO_D_3P3  (via drill 0.36)
  Top 0.152: v43.84,36.17 42.62,34.95 U5.25 | v45.87,36.17 46.08,35.97 47.7,35.97 47.7,34.95 JP1.11 | v64.97,28.85 63.96,28.85 U2.9 | v61.72,28.85 61.93,28.85 61.93,31.5 61.72,31.7 v61.72,34.75
  Bottom 0.152: v45.87,36.17 v43.84,36.17 | v61.72,28.85 v64.97,28.85 | v61.72,34.75 61.52,34.95 47.7,34.95 JP1.11
LCD_SCL  (via drill 0.36)
  Top 0.152: v94.03,27.23 94.03,27.43 95.05,27.43 R35.1
  Bottom 0.152: JP3.14 85.9,27.23 86.51,27.23 87.73,28.45 88.54,28.45 89.76,27.23 90.78,27.23 U5.65 90.98,27.23 v94.03,27.23
LCD_SDA  (via drill 0.36)
  Top 0.152: v95.05,23.16 95.05,21.74 R37.1 | v92.2,25.81 v92.2,23.16
  Bottom 0.152: 86.51,26.42 86.31,26.21 85.09,26.21 84.07,27.23 83.26,27.23 JP4.10 | 86.51,26.42 87.33,27.23 88.14,27.23 U5.66 | v92.2,23.16 v95.05,23.16 | v92.2,25.81 89.36,25.81 88.95,26.21 86.92,26.21 86.72,26.42 86.51,26.42
LED_FLOW_A  (via drill 0.36)
  Top 0.152: v69.85,34.95 69.85,34.14 U2.20 | v81.64,33.93 82.65,33.93 82.86,33.73 83.67,33.73 83.87,33.93 85.09,33.93 85.29,33.73 86.11,33.73 86.31,33.93 v87.33,33.93 | v116.18,33.12 116.18,31.5 R20.1
  Bottom 0.152: v69.85,34.95 70.05,35.15 80.82,35.15 81.64,34.34 v81.64,33.93 | v87.33,33.93 88.75,33.93 89.15,33.53 91.19,33.53 91.39,33.33 115.98,33.33 v116.18,33.12
LED_FLOW_A_3P3  (via drill 0.36)
  Top 0.152: v63.75,34.75 63.75,34.14 U2.1 | v49.94,34.34 50.14,34.14 50.14,30.07 49.94,29.87 49.94,25.4 50.14,25.2 v50.14,23.37
  Bottom 0.152: U5.16 40.18,22.15 40.79,22.15 41.81,21.13 43.03,21.13 44.04,22.15 45.06,22.15 JP2.8 45.26,22.15 45.87,22.15 47.09,23.37 v50.14,23.37 | v63.75,34.75 63.14,34.14 61.32,34.14 60.91,34.54 50.14,34.54 v49.94,34.34
LED_FLOW_B  (via drill 0.36)
  Top 0.152: v116.38,26.21 116.38,24.38 R23.1 | v89.56,26.62 89.36,26.82 89.36,27.64 88.14,28.85 87.73,28.85 86.92,29.67 86.92,30.28 86.11,31.09 85.29,31.09 85.09,30.89 v84.48,30.89 | v71.27,30.89 71.48,31.09 71.48,32.72 71.27,32.92 70.46,32.92 70.26,32.72 69.85,32.72 U2.18
  Bottom 0.152: v116.38,26.21 116.18,26.42 91.39,26.42 91.19,26.21 90.37,26.21 89.97,26.62 v89.56,26.62 | v84.48,30.89 83.67,30.89 83.46,31.09 82.86,31.09 82.65,30.89 81.84,30.89 81.64,31.09 71.48,31.09 v71.27,30.89
LED_FLOW_B_3P3  (via drill 0.36)
  Top 0.152: v64.36,35.56 64.57,35.36 64.57,34.34 64.77,34.14 64.77,32.72 63.96,32.72 U2.3 | v49.12,35.56 49.12,31.09 48.92,30.89 48.92,30.07 49.12,29.87 49.12,25.4 48.72,24.99 48.72,24.18 48.11,23.57 47.3,23.57 46.89,23.98 45.06,23.98 45.06,24.59 JP2.9
  Bottom 0.152: JP2.9 45.06,24.79 44.04,24.79 43.03,25.81 41.81,25.81 40.79,24.79 40.18,24.79 U5.18 | v64.36,35.56 64.16,35.36 49.33,35.36 v49.12,35.56
LED_FLOW_C  (via drill 0.36)
  Top 0.152: v68.63,31.7 68.63,32.11 69.65,32.11 U2.17 | v81.64,31.7 81.64,11.58 81.43,11.38 81.43,7.52 81.64,7.32 v81.64,1.02 | v108.86,14.22 v108.86,1.02 | v116.38,14.22 116.38,16.26 R29.1
  Bottom 0.152: v68.63,31.7 71.27,31.7 71.48,31.5 81.43,31.5 v81.64,31.7 | v81.64,1.02 81.84,0.81 108.66,0.81 v108.86,1.02 | v116.38,14.22 v108.86,14.22
LED_FLOW_C_3P3  (via drill 0.36)
  Top 0.152: v64.97,39.01 64.97,34.54 65.18,34.34 65.18,32.11 63.96,32.11 U2.4
  Bottom 0.152: U5.28 40.18,37.39 40.79,37.39 41.81,36.37 43.03,36.37 44.04,37.39 45.06,37.39 JP2.14 45.26,37.39 45.87,37.39 47.09,38.61 47.9,38.61 48.92,39.62 64.36,39.62 v64.97,39.01
LED_FLOW_D  (via drill 0.36)
  Top 0.152: v70.87,32.31 70.87,32.11 70.26,31.5 69.85,31.5 U2.16 | v80.62,32.11 81.03,31.7 81.03,31.29 81.23,31.09 81.23,13.21 80.42,12.39 80.42,11.58 80.62,11.38 80.62,7.52 80.42,7.32 80.42,2.03 v80.82,1.63 | v121.46,1.02 121.46,11.79 121.26,11.99 120.24,11.99 R32.1
  Bottom 0.152: v70.87,32.31 71.07,32.11 71.48,32.11 71.68,31.9 80.42,31.9 v80.62,32.11 | v80.82,1.63 82.04,1.63 82.45,1.22 108.05,1.22 108.46,1.63 109.27,1.63 110.08,0.81 121.26,0.81 v121.46,1.02
LED_FLOW_D_3P3  (via drill 0.36)
  Top 0.152: v66.4,41.66 66.4,31.5 63.96,31.5 U2.5
  Bottom 0.152: U5.30 40.18,40.03 40.79,40.03 41.81,41.05 43.03,41.05 44.04,40.03 45.06,40.03 JP2.15 45.26,40.03 46.08,40.03 47.3,41.25 49.94,41.25 50.34,40.84 64.36,40.84 64.57,41.05 64.97,41.05 65.38,41.45 66.19,41.45 v66.4,41.66
N$1
  Top 0.152: Q7.3 116.18,19.51 113.54,19.51 113.54,19.3 LED8.C
N$2
  Bottom 0.152: JP1.2 47.5,57.71 46.28,56.49 46.28,54.05 39.78,54.05 38.96,54.86 38.96,58.93 40.39,58.93 41.61,57.71 42.42,57.71 U5.43
N$3
  Bottom 0.152: JP1.1 47.5,60.35 46.69,60.35 45.47,59.13 44.65,59.13 43.43,60.35 42.62,60.35 U5.45
N$4  (via drill 0.36)
  Top 0.152: U5.7 43.43,11.18 44.04,11.18 v44.04,10.97
  Bottom 0.152: v44.04,10.97 45.67,10.97 46.28,11.58 46.48,11.58 46.89,11.99 47.5,11.99 JP1.20
N$5
  Top 0.152: U5.9 42.62,14.43 43.64,14.43 44.65,13.41 45.47,13.41 45.67,13.61 47.7,13.61 47.7,14.43 JP1.19
N$6
  Bottom 0.152: JP2.16 45.06,42.47 44.04,42.47 43.03,41.45 41.81,41.45 40.79,42.47 40.18,42.47 U5.32
N$7
  Bottom 0.152: JP1.17 47.5,19.71 46.69,19.71 45.47,18.49 44.65,18.49 43.43,19.71 42.62,19.71 U5.13
N$8
  Bottom 0.152: JP2.17 45.06,45.11 44.04,45.11 43.03,46.13 41.81,46.13 40.79,45.11 40.18,45.11 U5.34
N$9
  Bottom 0.152: JP2.18 45.06,47.55 44.04,47.55 43.03,46.53 41.81,46.53 40.79,47.55 40.18,47.55 U5.36
N$10
  Bottom 0.152: JP1.14 47.5,27.23 46.48,26.21 46.48,23.57 39.78,23.57 38.96,24.38 38.96,28.45 40.59,28.45 41.81,27.23 42.42,27.23 U5.19
N$11
  Bottom 0.152: JP2.19 45.06,50.19 44.04,50.19 43.03,51.21 41.81,51.21 40.79,50.19 40.18,50.19 U5.38
N$12
  Bottom 0.152: JP2.20 45.06,52.63 44.04,52.63 43.03,51.61 41.81,51.61 40.79,52.63 40.18,52.63 U5.40
N$13
  Bottom 0.152: JP2.21 45.06,55.27 44.04,55.27 43.03,56.29 41.81,56.29 40.79,55.27 40.18,55.27 U5.42
N$14
  Bottom 0.152: JP2.22 45.06,57.71 44.04,57.71 43.03,56.69 41.81,56.69 40.79,57.71 40.18,57.71 U5.44
N$15
  Bottom 0.152: JP2.23 45.06,60.35 44.04,60.35 43.03,61.37 41.81,61.37 40.79,60.35 40.18,60.35 U5.46
N$16  (via drill 0.36)
  Top 0.152: U5.31 43.43,41.66 44.04,41.66 v44.04,41.45
  Bottom 0.152: v44.04,41.45 45.67,41.45 46.28,42.06 46.48,42.06 46.89,42.47 47.5,42.47 JP1.8
N$17
  Top 0.152: U5.33 42.62,44.91 43.64,44.91 44.65,43.89 45.47,43.89 45.67,44.09 47.7,44.09 47.7,44.91 JP1.7
N$18
  Bottom 0.152: JP1.6 47.5,47.55 46.28,46.33 46.28,43.89 39.78,43.89 38.96,44.7 38.96,48.77 40.39,48.77 41.61,47.55 42.42,47.55 U5.35
N$19
  Bottom 0.152: JP1.5 47.5,50.19 46.69,50.19 45.47,48.97 44.65,48.97 43.43,50.19 42.62,50.19 U5.37
N$20  (via drill 0.36)
  Top 0.152: U5.39 43.43,51.82 44.04,51.82 v44.04,51.61
  Bottom 0.152: v44.04,51.61 45.67,51.61 46.28,52.22 46.48,52.22 46.89,52.63 47.5,52.63 JP1.4
N$21
  Top 0.152: U5.41 42.62,55.07 43.64,55.07 44.65,54.05 45.47,54.05 45.67,54.25 47.7,54.25 47.7,55.07 JP1.3
N$25
  Top 0.152: R28.1 110.08,22.15 110.08,20.93 110.49,20.52 110.49,19.3 LED8.A
N$26
  Top 0.152: R30.2 120.24,18.49 118.42,18.49 Q7.1 118.21,18.29 118.21,16.46 R29.2
N$27
  Bottom 0.152: JP2.4 45.06,11.99 44.04,11.99 43.03,10.97 41.81,10.97 40.79,11.99 40.18,11.99 U5.8
N$28
  Bottom 0.152: JP2.5 45.06,14.63 44.04,14.63 43.03,15.65 41.81,15.65 40.79,14.63 40.18,14.63 U5.10
N$42
  Top 0.152: Q8.3 115.98,12.8 113.34,12.8 LED9.C
N$49
  Bottom 0.152: U5.51 90.78,9.55 89.76,9.55 88.75,8.53 87.73,8.53 86.72,9.55 85.9,9.55 JP3.21
N$51
  Bottom 0.152: U5.55 90.78,14.63 89.76,14.63 88.75,15.65 87.73,15.65 86.72,14.63 85.9,14.63 JP3.19
N$52
  Bottom 0.152: U5.57 90.78,17.07 89.76,17.07 88.54,18.29 87.94,18.29 86.72,17.07 85.9,17.07 JP3.18
N$53
  Bottom 0.152: U5.59 90.78,19.71 89.76,19.71 88.75,20.73 87.73,20.73 86.72,19.71 85.9,19.71 JP3.17
N$54
  Bottom 0.152: U5.61 90.78,22.15 89.76,22.15 88.54,23.37 87.94,23.37 86.72,22.15 85.9,22.15 JP3.16
N$57
  Bottom 0.152: U5.67 90.78,29.87 89.76,29.87 88.75,30.89 87.73,30.89 86.72,29.87 85.9,29.87 JP3.13
N$60
  Bottom 0.152: U5.73 90.78,37.39 89.76,37.39 88.54,38.61 87.94,38.61 86.72,37.39 85.9,37.39 JP3.10
N$61
  Bottom 0.152: U5.75 90.78,40.03 89.76,40.03 88.75,41.05 87.73,41.05 86.72,40.03 85.9,40.03 JP3.9
N$62
  Bottom 0.152: U5.77 90.78,42.47 89.76,42.47 88.54,43.69 87.94,43.69 86.72,42.47 85.9,42.47 JP3.8
N$63
  Bottom 0.152: U5.79 90.78,45.11 89.76,45.11 88.75,46.13 87.73,46.13 86.72,45.11 85.9,45.11 JP3.7
N$64
  Bottom 0.152: U5.81 90.78,47.55 89.76,47.55 88.54,48.77 87.94,48.77 86.72,47.55 85.9,47.55 JP3.6
N$65
  Bottom 0.152: U5.83 90.78,50.19 89.76,50.19 88.75,51.21 87.73,51.21 86.72,50.19 85.9,50.19 JP3.5
N$66
  Bottom 0.152: U5.85 90.78,52.63 89.76,52.63 88.54,53.85 87.94,53.85 86.72,52.63 85.9,52.63 JP3.4
N$67
  Bottom 0.152: U5.87 90.78,55.27 89.76,55.27 88.75,54.25 87.73,54.25 86.72,55.27 85.9,55.27 JP3.3
N$69
  Bottom 0.152: U5.88 88.14,55.27 87.33,55.27 86.11,56.49 85.29,56.49 84.07,55.27 83.26,55.27 JP4.21
N$70  (via drill 0.36)
  Top 0.152: v116.79,86.77 116.79,85.55 D1.2 | Q1.3 118.62,82.5 118.42,82.5 v118.42,86.77 118.42,88.39 LED1.C 118.42,88.59 118.42,91.44 118.01,91.85 v118.01,100.99
  Bottom 0.152: v118.42,86.77 v116.79,86.77 | v118.01,100.99 119.63,100.99 RELAY_A.1
N$71  (via drill 0.36)
  Top 0.152: Q2.3 94.64,82.5 94.64,85.14 D2.2 94.64,85.34 94.64,87.99 LED2.C 94.64,88.19 v94.64,100.99
  Bottom 0.152: v94.64,100.99 97.89,100.99 RELAY_B.1
N$72
  Bottom 0.152: U5.52 88.14,9.55 87.33,9.55 86.11,10.77 85.29,10.77 84.07,9.55 83.26,9.55 JP4.3
N$73  (via drill 0.36)
  Top 0.152: Q3.3 71.07,82.5 71.07,85.14 D3.2 71.07,85.34 71.07,87.99 LED3.C 71.07,88.19 71.07,90.02 70.26,90.83 70.26,100.79 v70.46,100.99
  Bottom 0.152: v70.46,100.99 75.95,100.99 RELAY_C.1
N$74
  Bottom 0.152: U5.56 88.14,14.63 87.33,14.63 86.11,13.41 85.29,13.41 84.07,14.63 83.26,14.63 JP4.5
N$75
  Bottom 0.152: U5.58 88.14,17.07 87.33,17.07 86.31,16.05 85.09,16.05 84.07,17.07 83.26,17.07 JP4.6
N$76
  Bottom 0.152: U5.60 88.14,19.71 87.33,19.71 86.11,18.49 85.29,18.49 84.07,19.71 83.26,19.71 JP4.7
N$77
  Bottom 0.152: U5.62 88.14,22.15 87.33,22.15 86.31,21.13 85.09,21.13 84.07,22.15 83.26,22.15 JP4.8
N$80
  Bottom 0.152: U5.68 88.14,29.87 87.33,29.87 86.11,28.65 85.29,28.65 84.07,29.87 83.26,29.87 JP4.11
N$81
  Bottom 0.152: U5.70 88.14,32.31 87.33,32.31 86.31,31.29 85.09,31.29 84.07,32.31 83.26,32.31 JP4.12
N$82
  Bottom 0.152: U5.72 88.14,34.95 87.33,34.95 86.11,33.73 85.29,33.73 84.07,34.95 83.26,34.95 JP4.13
N$83
  Bottom 0.152: U5.74 88.14,37.39 87.33,37.39 86.31,36.37 85.09,36.37 84.07,37.39 83.26,37.39 JP4.14
N$84
  Bottom 0.152: U5.76 88.14,40.03 87.33,40.03 86.11,38.81 85.29,38.81 84.07,40.03 83.26,40.03 JP4.15
N$85
  Bottom 0.152: U5.78 88.14,42.47 87.33,42.47 86.31,41.45 85.09,41.45 84.07,42.47 83.26,42.47 JP4.16
N$86
  Bottom 0.152: U5.80 88.14,45.11 87.33,45.11 86.11,43.89 85.29,43.89 84.07,45.11 83.26,45.11 JP4.17
N$87
  Bottom 0.152: U5.82 88.14,47.55 87.33,47.55 86.31,46.53 85.09,46.53 84.07,47.55 83.26,47.55 JP4.18
N$88
  Bottom 0.152: U5.84 88.14,50.19 87.33,50.19 86.11,48.97 85.29,48.97 84.07,50.19 83.26,50.19 JP4.19
N$89
  Bottom 0.152: U5.86 88.14,52.63 87.33,52.63 86.31,51.61 85.09,51.61 84.07,52.63 83.26,52.63 JP4.20
N$90  (via drill 0.36)
  Top 0.152: Q4.3 51.56,81.69 50.75,81.69 50.75,84.94 D4.2 50.75,85.14 50.75,86.56 50.55,86.77 50.55,87.99 LED4.C 50.55,88.19 v50.55,100.99
  Bottom 0.152: v50.55,100.99 52.17,100.99 RELAY_D.1
N$91
  Top 0.152: R5.2 111.71,83.52 113.13,83.52 R6.2 113.34,83.52 114.55,83.52 114.76,83.31 116.59,83.31 Q1.1
N$92
  Top 0.152: Q2.1 92.61,83.31 91.59,83.31 91.59,81.89 90.98,81.89 R8.2 90.78,81.89 88.95,81.89 88.75,82.09 88.75,82.91 R7.2
N$93
  Top 0.152: 66.8,81.48 67.21,81.48 67.41,81.69 67.41,83.31 68.83,83.31 Q3.1 | 66.8,81.48 64.97,81.48 64.97,82.3 R10.2 | 66.8,81.48 R9.2
N$94
  Top 0.152: Q4.1 49.53,82.7 48.31,82.7 48.31,80.87 47.9,80.87 R12.2 47.7,80.87 47.09,80.87 47.09,82.5 R11.2
N$95
  Top 0.152: LED5.A 99.31,62.38 97.49,62.38 R19.2
N$96  (via drill 0.36)
  Top 0.152: v111.1,100.99 110.9,101.19 110.9,112.78 HEADER-RELAY.8
  Bottom 0.152: v111.1,100.99 109.47,100.99 RELAY_A.2
N$97  (via drill 0.36)
  Top 0.152: v107.44,100.99 107.44,112.78 HEADER-RELAY.7
  Bottom 0.152: v107.44,100.99 101.96,100.99 RELAY_A.3
N$98  (via drill 0.36)
  Top 0.152: v87.94,102.82 87.94,100.99 RELAY_B.2 | v103.78,102.82 103.78,112.78 HEADER-RELAY.6
  Bottom 0.152: v103.78,102.82 v87.94,102.82
N$99  (via drill 0.36)
  Top 0.152: v80.21,103.43 80.21,100.99 RELAY_B.3 | v100.33,103.43 100.33,112.78 HEADER-RELAY.5
  Bottom 0.152: v80.21,103.43 88.34,103.43 88.54,103.23 100.13,103.23 v100.33,103.43
N$100
  Top 0.152: R31.1 109.88,15.44 109.88,14.22 110.29,13.82 110.29,13.01 LED9.A
N$101
  Top 0.152: Q8.1 118.21,11.79 118.21,10.16 R33.2 118.42,10.16 120.04,10.16 R32.2
N$102
  Top 0.152: 106.22,37.39 106.43,37.39 TP2.TP 106.22,37.39 | 106.22,37.39 104.39,37.39 102.77,35.76 R34.1 | 106.22,37.39 106.22,72.34 104.6,72.34 U4.7
N$106  (via drill 0.36)
  Top 0.152: v65.79,104.04 RELAY_C.2 | v96.88,103.83 96.88,112.78 HEADER-RELAY.4
  Bottom 0.152: v65.79,104.04 80.62,104.04 80.82,103.83 88.54,103.83 88.75,103.63 96.67,103.63 v96.88,103.83
N$107  (via drill 0.36)
  Top 0.152: v58.27,104.65 58.27,100.99 RELAY_C.3 | v93.42,104.24 93.42,112.78 HEADER-RELAY.3
  Bottom 0.152: v58.27,104.65 66.19,104.65 66.4,104.44 80.82,104.44 81.03,104.24 88.75,104.24 88.95,104.04 93.22,104.04 v93.42,104.24
N$108  (via drill 0.36)
  Top 0.152: v42.22,105.26 42.22,100.99 RELAY_D.2 | v89.76,104.65 89.76,112.78 HEADER-RELAY.2
  Bottom 0.152: v42.22,105.26 58.67,105.26 58.88,105.05 66.4,105.05 66.6,104.85 81.03,104.85 81.23,104.65 v89.76,104.65
N$109  (via drill 0.36)
  Top 0.152: v34.49,105.87 34.49,100.99 RELAY_D.3 | v86.31,105.26 86.31,112.78 HEADER-RELAY.1
  Bottom 0.152: v34.49,105.87 42.62,105.87 42.82,105.66 58.88,105.66 59.08,105.46 66.6,105.46 66.8,105.26 81.23,105.26 81.43,105.05 86.11,105.05 v86.31,105.26
N$111  (via drill 0.36)
  Top 0.152: v111.71,89.81 111.71,86.36 R1.1 | v115.37,89.81 115.37,88.59 LED1.A
  Bottom 0.152: v115.37,89.81 v111.71,89.81
N$112
  Top 0.152: R2.1 90.58,85.34 90.58,86.16 91.8,87.38 91.8,87.99 LED2.A
N$113  (via drill 0.36)
  Top 0.152: v65.18,86.56 65.18,85.34 R3.1 | v68.02,86.56 68.02,87.99 LED3.A
  Bottom 0.152: v68.02,86.56 v65.18,86.56
N$114  (via drill 0.36)
  Top 0.152: v43.84,86.97 43.84,85.75 R4.1 | v47.5,86.77 47.5,87.99 LED4.A
  Bottom 0.152: v43.84,86.97 44.04,86.77 v47.5,86.77
N$117
  Top 0.152: Q5.3 115.98,34.14 113.34,34.14 LED6.C
N$118
  Top 0.152: R13.1 109.88,36.78 109.88,35.56 110.29,35.15 110.29,34.34 LED6.A
N$119
  Top 0.152: R20.2 118.01,31.5 118.01,33.12 Q5.1 118.21,33.12 119.84,33.12 120.04,32.92 R21.2
N$120
  Top 0.152: Q6.3 115.57,27.23 113.34,27.23 LED7.C
N$121
  Top 0.152: R14.1 110.08,30.07 110.08,28.85 110.29,28.65 110.29,27.43 LED7.A
N$122
  Top 0.152: 118.21,26.42 118.01,26.42 Q6.1 118.21,26.42 | 118.21,26.42 118.21,24.38 R23.2 | 118.21,26.42 118.42,26.42 118.62,26.21 120.04,26.21 R24.2
ONEWIRE_A  (via drill 0.36)
  Top 0.152: v33.27,34.75 33.07,34.54 33.07,32.31 33.48,32.31 Q9.3 | v31.04,34.75 v31.04,40.64 31.04,41.05 30.02,42.06 30.02,43.28 R18.1 30.02,43.48 30.02,45.31 28.8,46.53 28.8,49.58 U1.1 | v22.3,40.84 22.3,39.83 R26.1 | v15.6,40.44 v15.6,58.52
  Bottom 0.152: v31.04,34.75 v33.27,34.75 | 22.1,40.64 21.9,40.44 17.83,40.44 RJ1.1 17.63,40.44 v15.6,40.44 | v15.6,58.52 17.22,58.52 RJ2.1 | 22.1,40.64 v31.04,40.64 | 22.1,40.64 v22.3,40.84
ONEWIRE_A_3P3  (via drill 0.36)
  Top 0.152: v34.7,33.73 34.7,32.92 35.31,32.92 Q9.2 | v29.82,33.73 29.82,32.31 R17.1 | v37.34,33.73 37.34,33.12 37.14,32.92 37.14,30.68 36.73,30.28 36.73,27.23 36.12,26.62 36.12,8.33 v36.32,8.13
  Bottom 0.152: v29.82,33.73 v34.7,33.73 v37.34,33.73 | 38.96,8.13 38.96,6.5 39.98,5.49 43.23,5.49 43.43,5.69 45.47,5.69 46.69,6.91 47.5,6.91 JP1.22 | 38.96,8.13 40.39,8.13 41.61,6.91 42.42,6.91 U5.3 | 38.96,8.13 v36.32,8.13
ONEWIRE_B  (via drill 0.36)
  Top 0.152: RJ1.4 22.3,36.58 R27.1 22.5,36.78 22.5,38.41 23.11,39.01 23.11,41.05 v23.32,41.25 | v35.31,41.25 35.31,44.3 Q10.3 | v29.82,41.25 29.82,40.03 R40.1 | v27.38,54.66 27.38,44.7 27.18,44.5 v27.18,41.25
  Bottom 0.152: v35.31,41.25 v29.82,41.25 29.62,41.05 27.38,41.05 | v27.38,54.66 19.86,54.66 RJ2.4 | v23.32,41.25 23.52,41.05 27.38,41.05 | 27.38,41.05 v27.18,41.25
ONEWIRE_B_3P3  (via drill 0.36)
  Top 0.152: v35.92,43.48 35.92,42.67 Q10.2 | v31.65,43.48 31.65,40.23 31.45,40.03 31.45,35.36 31.65,35.15 31.65,34.34 | 31.65,34.34 31.45,34.14 30.43,34.14 29.82,34.75 29.82,35.97 R39.1 | v34.29,8.74 34.49,8.94 34.49,25.2 32.26,27.43 32.26,33.73 31.65,34.34
  Bottom 0.152: JP1.21 47.5,9.55 46.69,9.55 45.47,8.33 44.65,8.33 43.43,9.55 42.62,9.55 U5.5 42.42,9.55 41.4,9.55 41,9.14 41,8.94 40.59,8.53 36.93,8.53 36.73,8.74 v34.29,8.74 | v31.65,43.48 v35.92,43.48
ONEWIRE_C_3P3
  Bottom 0.152: JP1.18 47.5,17.07 46.28,15.85 46.28,13.41 39.78,13.41 38.96,14.22 38.96,18.29 40.39,18.29 41.61,17.07 42.42,17.07 U5.11
ONEWIRE_D_3P3  (via drill 0.36)
  Top 0.152: U5.15 43.43,21.34 44.04,21.34 v44.04,21.13
  Bottom 0.152: v44.04,21.13 45.67,21.13 46.69,22.15 47.5,22.15 JP1.16
RELAY_A  (via drill 0.36)
  Top 0.152: v68.43,51.41 68.43,48.16 69.65,48.16 U3.17 | v75.34,51.41 75.74,51.82 75.74,61.16 75.34,61.57 v75.34,64.21 | v109.88,64.21 109.88,83.31 R5.1
  Bottom 0.152: v68.43,51.41 71.27,51.41 71.48,51.61 75.13,51.61 v75.34,51.41 | v75.34,64.21 81.84,64.21 82.04,64.41 96.06,64.41 96.27,64.21 97.08,64.21 97.28,64.41 102.36,64.41 102.57,64.21 v109.88,64.21
RELAY_A_3P3  (via drill 0.36)
  Top 0.152: v62.74,48.36 62.74,48.16 63.75,48.16 U3.4 | v58.88,48.36 58.88,46.74 59.08,46.53 59.08,42.88 59.89,42.06 59.89,32.51 59.69,32.31 59.69,29.87 59.49,29.67 v59.49,26.21 | v48.51,26.21 47.09,26.21 46.69,26.62 45.06,26.62 45.06,27.23 JP2.10
  Bottom 0.152: JP2.10 45.06,27.23 44.04,27.23 43.03,26.21 41.81,26.21 40.79,27.23 40.18,27.23 U5.20 | v58.88,48.36 v62.74,48.36 | v48.51,26.21 v59.49,26.21
RELAY_B  (via drill 0.36)
  Top 0.152: v68.63,47.35 69.65,47.35 U3.16 | v76.35,47.35 76.35,51 76.56,51.21 v76.56,65.43 | v86.92,65.43 86.92,82.91 R7.1
  Bottom 0.152: v76.35,47.35 v68.63,47.35 | v76.56,65.43 81.84,65.43 82.04,65.23 86.72,65.23 v86.92,65.43
RELAY_B_3P3  (via drill 0.36)
  Top 0.152: v62.74,47.35 63.75,47.35 U3.5 | v59.49,47.14 59.49,43.08 60.3,42.27 60.3,32.31 60.1,32.11 v60.1,29.26 | v46.48,28.65 46.08,29.06 45.06,29.06 45.06,29.67 JP2.11
  Bottom 0.152: JP2.11 45.06,29.87 44.04,29.87 43.03,30.89 41.81,30.89 40.79,29.87 40.18,29.87 U5.22 | v62.74,47.35 62.54,47.14 v59.49,47.14 | v60.1,29.26 59.89,29.46 48.92,29.46 48.11,28.65 v46.48,28.65
RELAY_C  (via drill 0.36)
  Top 0.152: v66.8,78.64 R9.1 | v70.26,78.64 70.05,78.44 70.05,51 v70.26,50.8 | v70.87,48.56 70.87,47.35 70.26,46.74 69.85,46.74 U3.15
  Bottom 0.152: v70.26,78.64 v66.8,78.64 | v70.26,50.8 70.26,48.56 v70.87,48.56
RELAY_C_3P3  (via drill 0.36)
  Top 0.152: v60.71,31.7 60.71,46.74 63.75,46.74 U3.6 | v46.48,30.89 45.26,32.11 45.06,32.11 45.06,32.31 JP2.12
  Bottom 0.152: JP2.12 45.06,32.31 44.04,32.31 43.03,31.29 41.81,31.29 40.79,32.31 40.18,32.31 U5.24 | v60.71,31.7 60.5,31.9 48.72,31.9 47.9,31.09 47.3,31.09 47.09,30.89 v46.48,30.89
RELAY_D  (via drill 0.36)
  Top 0.152: v45.26,76.2 45.26,82.5 R11.1 | v70.66,76.2 70.46,76 70.46,53.65 v70.66,53.44 | v73.71,46.13 v73.71,53.44 | v70.87,46.13 69.85,46.13 U3.14
  Bottom 0.152: v45.26,76.2 45.47,76 68.02,76 68.22,76.2 v70.66,76.2 | v73.71,53.44 v70.66,53.44 | v70.87,46.13 v73.71,46.13
RELAY_D_3P3  (via drill 0.36)
  Top 0.152: v64.57,41.66 64.77,41.86 64.77,46.13 63.96,46.13 U3.7 | v50.75,33.73 v50.75,41.45 | v48.51,33.73 47.3,33.73 46.89,34.14 45.06,34.14 45.06,34.75 JP2.13
  Bottom 0.152: JP2.13 45.06,34.95 44.04,34.95 43.03,35.97 41.81,35.97 40.79,34.95 40.18,34.95 U5.26 | v64.57,41.66 64.16,41.25 50.95,41.25 v50.75,41.45 | v48.51,33.73 v50.75,33.73
RESET  (via drill 0.36)
  Top 0.152: v68.63,45.92 68.83,45.72 68.83,44.91 69.65,44.91 U3.12 | v67.41,46.94 67.62,47.14 67.62,50.19 67.41,50.39 67.41,52.02 68.83,53.44 68.83,75.39 v68.63,75.59 | v40.39,75.59 40.39,102.41 41.4,103.43 41.4,111.35 GPO.2
  Bottom 0.152: SW1.4 35.92,75.59 v40.39,75.59 42.22,75.59 SW1.3 42.42,75.59 v68.63,75.59 | v68.63,45.92 67.62,46.94 v67.41,46.94
RESET_3P3  (via drill 0.36)
  Top 0.152: v62.74,44.91 63.75,44.91 U3.9 | v67.01,44.91 67.01,41.25 66.8,41.05 66.8,36.17 v67.01,35.97
  Bottom 0.152: U5.71 90.78,34.95 89.76,34.95 88.75,35.97 87.73,35.97 86.72,34.95 85.9,34.95 JP3.11 85.7,34.95 84.68,34.95 83.46,36.17 82.86,36.17 82.65,35.97 v67.01,35.97 | v67.01,44.91 v62.74,44.91
TEST_PULSE
  Top 0.152: U3.18 69.65,48.77 68.83,48.77 68.83,50.19 69.65,51 69.65,80.06 70.05,80.47 70.05,84.33 69.85,84.53 69.85,107.09 70.46,107.7 70.46,109.53 TEST_B.1 70.46,109.73 70.46,114.61 TEST_A.1 | TEST_D.1 61.72,111.56 61.93,111.76 61.93,114.81 TEST_C.1
  Bottom 0.152: TEST_B.1 70.26,109.53 65.99,109.53 64.77,108.31 63.75,108.31 62.54,109.53 61.72,109.53 TEST_D.1
TEST_PULSE_3P3  (via drill 0.36)
  Top 0.152: v65.18,40.03 65.18,48.77 63.96,48.77 U3.3
  Bottom 0.152: U5.29 42.62,40.03 43.43,40.03 44.65,38.81 45.47,38.81 46.69,40.03 47.5,40.03 JP1.9 47.7,40.03 v65.18,40.03

## Text on the board
tPlace: Flying Squirrel / Controller | 45 | 46 | BeagleBeer / www.vencaf.org | Rev. 2 (April 2013) / Made in the USA | 1 | 1